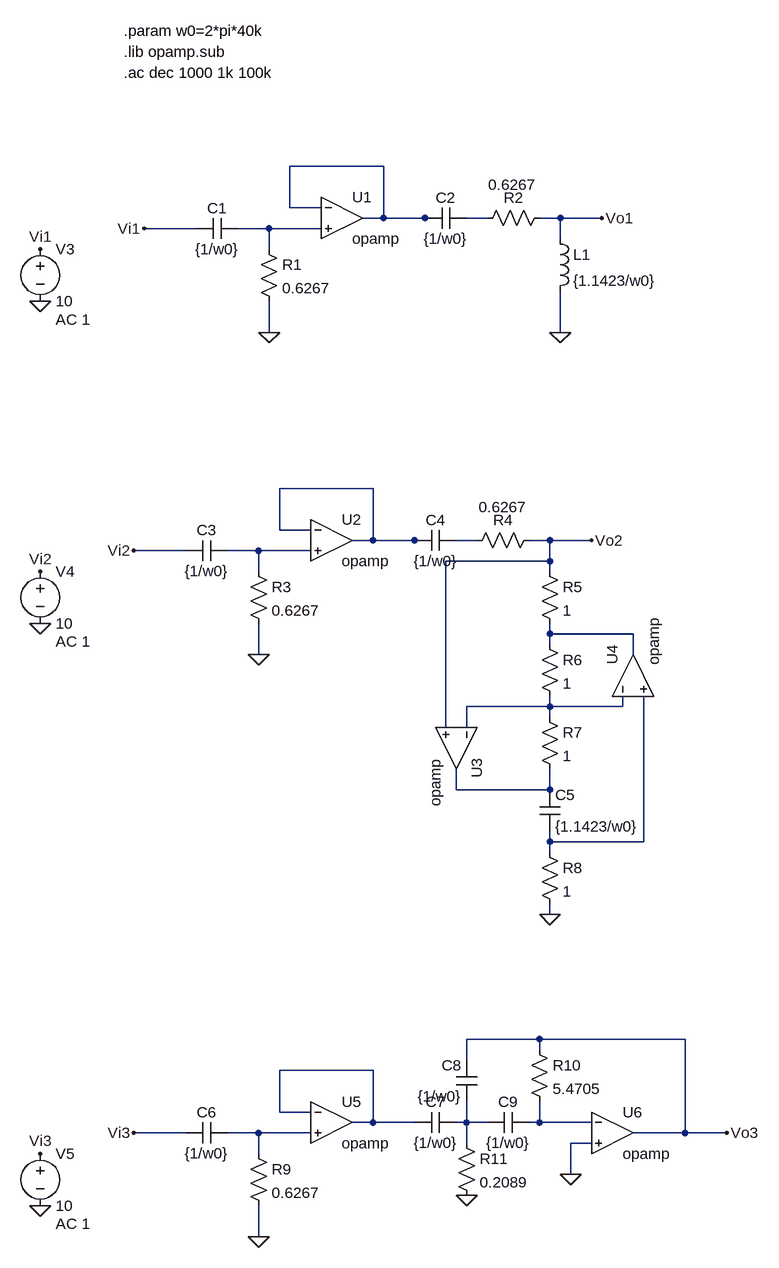
[diagram p0: schematic TS3-Contreras.asc]
TS3-Contreras.asc, the LTspice schematic file:
Version 4.1
SHEET 1 1236 1940
WIRE 400 16 256 16
WIRE 256 80 256 16
WIRE 304 80 256 80
WIRE 400 96 400 16
WIRE 400 96 368 96
WIRE 464 96 400 96
WIRE 480 96 464 96
WIRE 560 96 528 96
WIRE 672 96 640 96
WIRE 736 96 672 96
WIRE 112 112 32 112
WIRE 224 112 176 112
WIRE 304 112 224 112
WIRE 672 128 672 96
WIRE 224 144 224 112
WIRE 224 272 224 224
WIRE 672 272 672 208
WIRE 384 512 240 512
WIRE 240 576 240 512
WIRE 288 576 240 576
WIRE 384 592 384 512
WIRE 384 592 352 592
WIRE 448 592 384 592
WIRE 464 592 448 592
WIRE 544 592 512 592
WIRE 656 592 624 592
WIRE 720 592 656 592
WIRE 96 608 16 608
WIRE 208 608 160 608
WIRE 288 608 208 608
WIRE 656 624 656 592
WIRE 656 624 496 624
WIRE 208 640 208 608
WIRE 656 640 656 624
WIRE 656 736 656 720
WIRE 784 736 656 736
WIRE 656 752 656 736
WIRE 208 768 208 720
WIRE 784 768 784 736
WIRE 656 848 656 832
WIRE 656 848 528 848
WIRE 768 848 768 832
WIRE 768 848 656 848
WIRE 656 864 656 848
WIRE 496 880 496 624
WIRE 528 880 528 848
WIRE 512 976 512 944
WIRE 656 976 656 944
WIRE 656 976 512 976
WIRE 656 1056 656 1040
WIRE 800 1056 800 832
WIRE 800 1056 656 1056
WIRE 656 1072 656 1056
WIRE 656 1168 656 1152
WIRE 640 1360 528 1360
WIRE 864 1360 640 1360
WIRE 640 1376 640 1360
WIRE 528 1392 528 1360
WIRE 384 1408 240 1408
WIRE 240 1472 240 1408
WIRE 288 1472 240 1472
WIRE 384 1488 384 1408
WIRE 384 1488 352 1488
WIRE 448 1488 384 1488
WIRE 528 1488 528 1456
WIRE 528 1488 512 1488
WIRE 560 1488 528 1488
WIRE 640 1488 640 1456
WIRE 640 1488 624 1488
WIRE 720 1488 640 1488
WIRE 96 1504 16 1504
WIRE 208 1504 160 1504
WIRE 288 1504 208 1504
WIRE 864 1504 864 1360
WIRE 864 1504 784 1504
WIRE 928 1504 864 1504
WIRE 528 1520 528 1488
WIRE 720 1520 688 1520
WIRE 208 1536 208 1504
WIRE 688 1568 688 1520
WIRE 208 1664 208 1616
FLAG 224 272 0
FLAG 672 272 0
FLAG 32 112 Vi1
FLAG 736 96 Vo1
FLAG -128 224 0
FLAG -128 144 Vi1
FLAG 208 768 0
FLAG 16 608 Vi2
FLAG 720 592 Vo2
FLAG 656 1168 0
FLAG -128 720 0
FLAG -128 640 Vi2
FLAG 208 1664 0
FLAG 16 1504 Vi3
FLAG -128 1616 0
FLAG -128 1536 Vi3
FLAG 528 1600 0
FLAG 688 1568 0
FLAG 928 1504 Vo3
SYMBOL cap 176 96 R90
WINDOW 0 0 32 VBottom 2
WINDOW 3 32 32 VTop 2
SYMATTR InstName C1
SYMATTR Value {1/w0}
SYMBOL res 208 128 R0
SYMATTR InstName R1
SYMATTR Value 0.6267
SYMBOL cap 528 80 R90
WINDOW 0 0 32 VBottom 2
WINDOW 3 32 32 VTop 2
SYMATTR InstName C2
SYMATTR Value {1/w0}
SYMBOL res 656 80 R90
WINDOW 0 0 56 VBottom 2
WINDOW 3 -51 58 VTop 2
SYMATTR InstName R2
SYMATTR Value 0.6267
SYMBOL ind 656 112 R0
SYMATTR InstName L1
SYMATTR Value {1.1423/w0}
SYMBOL voltage -128 128 R0
WINDOW 123 24 124 Left 2
WINDOW 39 0 0 Left 0
SYMATTR Value2 AC 1
SYMATTR InstName V3
SYMATTR Value 10
SYMBOL cap 160 592 R90
WINDOW 0 0 32 VBottom 2
WINDOW 3 32 32 VTop 2
SYMATTR InstName C3
SYMATTR Value {1/w0}
SYMBOL res 192 624 R0
SYMATTR InstName R3
SYMATTR Value 0.6267
SYMBOL cap 512 576 R90
WINDOW 0 0 32 VBottom 2
WINDOW 3 32 32 VTop 2
SYMATTR InstName C4
SYMATTR Value {1/w0}
SYMBOL res 640 576 R90
WINDOW 0 0 56 VBottom 2
WINDOW 3 -51 56 VTop 2
SYMATTR InstName R4
SYMATTR Value 0.6267
SYMBOL res 640 624 R0
SYMATTR InstName R5
SYMATTR Value 1
SYMBOL res 640 736 R0
SYMATTR InstName R6
SYMATTR Value 1
SYMBOL res 640 848 R0
SYMATTR InstName R7
SYMATTR Value 1
SYMBOL cap 640 976 R0
SYMATTR InstName C5
SYMATTR Value {1.1423/w0}
SYMBOL res 640 1056 R0
SYMATTR InstName R8
SYMATTR Value 1
SYMBOL voltage -128 624 R0
WINDOW 123 24 124 Left 2
WINDOW 39 0 0 Left 0
SYMATTR Value2 AC 1
SYMATTR InstName V4
SYMATTR Value 10
SYMBOL cap 160 1488 R90
WINDOW 0 0 32 VBottom 2
WINDOW 3 32 32 VTop 2
SYMATTR InstName C6
SYMATTR Value {1/w0}
SYMBOL res 192 1520 R0
SYMATTR InstName R9
SYMATTR Value 0.6267
SYMBOL voltage -128 1520 R0
WINDOW 123 24 124 Left 2
WINDOW 39 0 0 Left 0
SYMATTR Value2 AC 1
SYMATTR InstName V5
SYMATTR Value 10
SYMBOL cap 512 1472 R90
WINDOW 0 0 32 VBottom 2
WINDOW 3 32 32 VTop 2
SYMATTR InstName C7
SYMATTR Value {1/w0}
SYMBOL cap 544 1456 R180
WINDOW 0 24 56 Left 2
WINDOW 3 24 8 Left 2
SYMATTR InstName C8
SYMATTR Value {1/w0}
SYMBOL res 624 1360 R0
SYMATTR InstName R10
SYMATTR Value 5.4705
SYMBOL cap 624 1472 R90
WINDOW 0 0 32 VBottom 2
WINDOW 3 32 32 VTop 2
SYMATTR InstName C9
SYMATTR Value {1/w0}
SYMBOL res 512 1504 R0
SYMATTR InstName R11
SYMATTR Value 0.2089
SYMBOL OpAmps\\opamp 336 32 R0
SYMATTR InstName U1
SYMBOL OpAmps\\opamp 320 528 R0
SYMATTR InstName U2
SYMBOL OpAmps\\opamp 576 912 R90
SYMATTR InstName U3
SYMBOL OpAmps\\opamp 720 800 R270
SYMATTR InstName U4
SYMBOL OpAmps\\opamp 320 1424 R0
SYMATTR InstName U5
SYMBOL OpAmps\\opamp 752 1440 R0
SYMATTR InstName U6
TEXT 0 -128 Left 2 !.ac dec 1000 1k 100k
TEXT 0 -192 Left 2 !.param w0=2*pi*40k
TEXT 0 -160 Left 2 !.lib opamp.sub

The netlist it stands for:
* TS3-Contreras.asc
C1 N003 Vi1 {1/w0}
R1 N003 0 0.6267
C2 N002 N001 {1/w0}
R2 Vo1 N002 0.6267
L1 Vo1 0 {1.1423/w0}
V3 Vi1 0 10 AC 1
C3 N006 Vi2 {1/w0}
R3 N006 0 0.6267
C4 N005 N004 {1/w0}
R4 Vo2 N005 0.6267
R5 Vo2 N007 1
R6 N007 N008 1
R7 N008 N009 1
C5 N009 N010 {1.1423/w0}
R8 N010 0 1
V4 Vi2 0 10 AC 1
C6 N014 Vi3 {1/w0}
R9 N014 0 0.6267
V5 Vi3 0 10 AC 1
C7 N012 N011 {1/w0}
C8 N012 Vo3 {1/w0}
R10 Vo3 N013 5.4705
C9 N013 N012 {1/w0}
R11 N012 0 0.2089
X§U1 N001 N003 N001 opamp Aol=100K GBW=10Meg  ; pins invin noninvin out
X§U2 N004 N006 N004 opamp Aol=100K GBW=10Meg  ; pins invin noninvin out
X§U3 N008 Vo2 N009 opamp Aol=100K GBW=10Meg  ; pins invin noninvin out
X§U4 N008 N010 N007 opamp Aol=100K GBW=10Meg  ; pins invin noninvin out
X§U5 N011 N014 N011 opamp Aol=100K GBW=10Meg  ; pins invin noninvin out
X§U6 N013 0 Vo3 opamp Aol=100K GBW=10Meg  ; pins invin noninvin out
.ac dec 1000 1k 100k
.param w0=2*pi*40k
.lib opamp.sub
.backanno
.end